# Altium schematic sheet Sheet1.SchDoc
size B; SheetNumber: 1; SheetTotal: 1
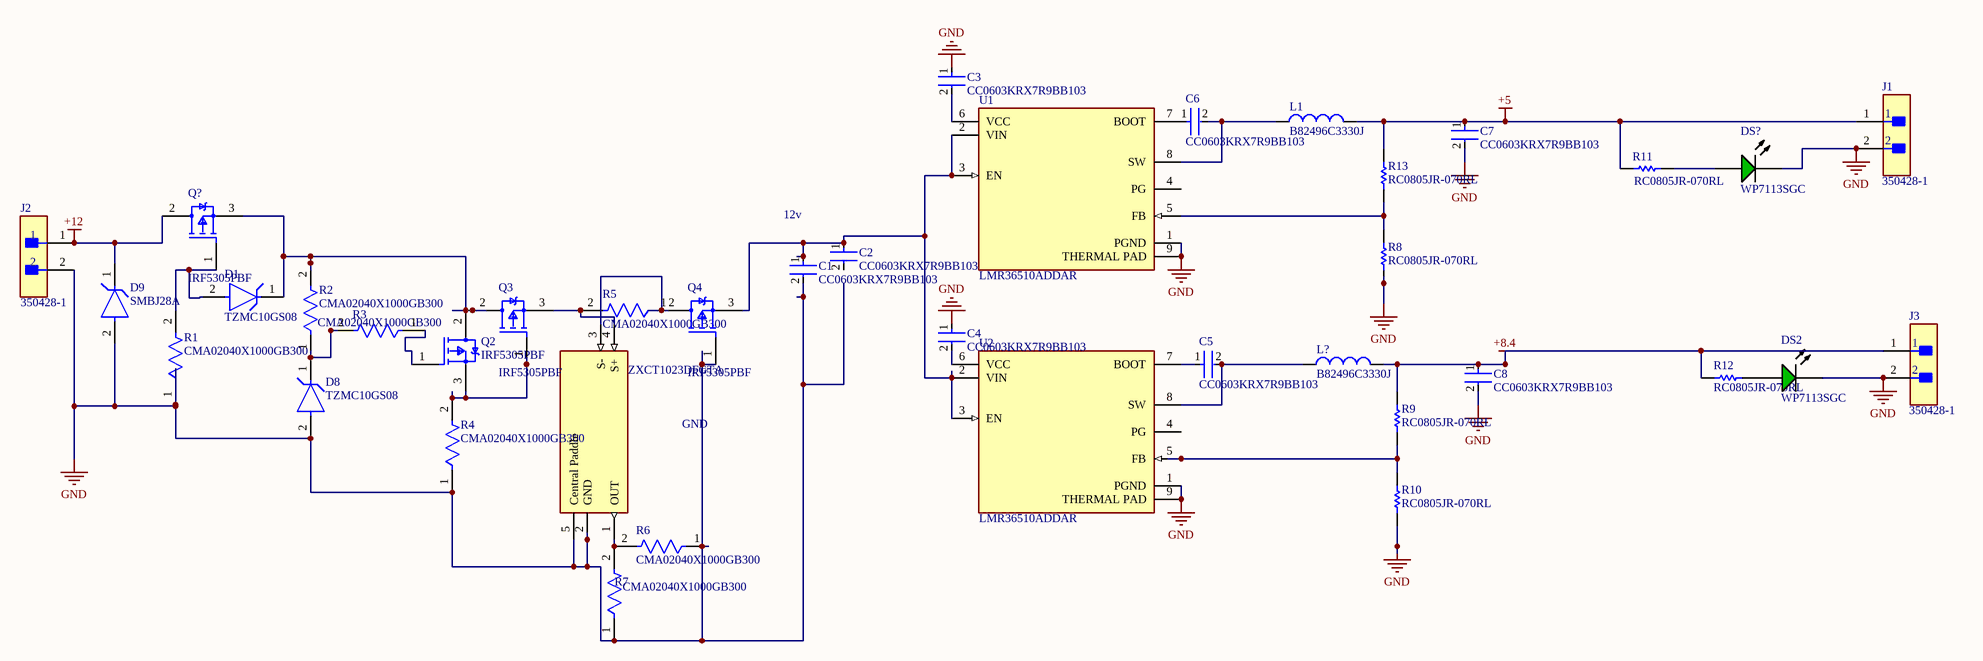
[diagram p0: Sheet1.SchDoc]

## Parts
?  ZXCT1023DFGTA  [FP-TDFN1218-4-MFG]
C1  CC0603KRX7R9BB103  [FP-CC0603-DA-MFG]
C2  CC0603KRX7R9BB103  [FP-CC0603-DA-MFG]
C3  CC0603KRX7R9BB103  [FP-CC0603-DA-MFG]
C4  CC0603KRX7R9BB103  [FP-CC0603-DA-MFG]
C5  CC0603KRX7R9BB103  [FP-CC0603-DA-MFG]
C6  CC0603KRX7R9BB103  [FP-CC0603-DA-MFG]
C7  CC0603KRX7R9BB103  [FP-CC0603-DA-MFG]
C8  CC0603KRX7R9BB103  [FP-CC0603-DA-MFG]
D1  TZMC10GS08  [FP-6_560-5005_01-4-MFG]
D8  TZMC10GS08  [FP-6_560-5005_01-4-MFG]
D9  SMBJ28A  [FP-SMBJ-MFG]
DS2  WP7113SGC  [KING-WP7113SGC_V]
DS?  WP7113SGC  [KING-WP7113SGC_V]
J1  350428-1  [FP-350428-1-MFG]
J2  350428-1  [FP-350428-1-MFG]
J3  350428-1  [FP-350428-1-MFG]
L1  B82496C3330J  [INDC1608X90X30LL10T20]
L?  B82496C3330J  [INDC1608X90X30LL10T20]
Q2  IRF5305PBF  [FP-PG-TO220-3-0]
Q3  IRF5305PBF  [FP-PG-TO220-3-0]
Q4  IRF5305PBF  [FP-PG-TO220-3-0]
Q?  IRF5305PBF  [FP-PG-TO220-3-0]
R1  CMA02040X1000GB300  [FP-CMA0204-MFG]
R2  CMA02040X1000GB300  [FP-CMA0204-MFG]
R3  CMA02040X1000GB300  [FP-CMA0204-MFG]
R4  CMA02040X1000GB300  [FP-CMA0204-MFG]
R5  CMA02040X1000GB300  [FP-CMA0204-MFG]
R6  CMA02040X1000GB300  [FP-CMA0204-MFG]
R7  CMA02040X1000GB300  [FP-CMA0204-MFG]
R8  RC0805JR-070RL  [RESC2013X60X35ML10T20]
R9  RC0805JR-070RL  [RESC2013X60X35ML10T20]
R10  RC0805JR-070RL  [RESC2013X60X35ML10T20]
R11  RC0805JR-070RL  [RESC2013X60X35ML10T20]
R12  RC0805JR-070RL  [RESC2013X60X35ML10T20]
R13  RC0805JR-070RL  [RESC2013X60X35ML10T20]
U1  LMR36510ADDAR  [FP-DDA0008E-IPC_A]
U2  LMR36510ADDAR  [FP-DDA0008E-IPC_A]

## Nets
+5: C7.1 J1.1 L1.2 R11.2 R13.2
+8.4: C8.1 J3.1 L?.2 R9.2 R12.2
+12: D9.1(C) J2.1 Q?.2(D)
GND: ?.2(GND) ?.5(Central_Paddle) C1.2 C3.1 C4.1 C7.2 C8.2 D8.2(A) D9.2(A) DS2.2(K) DS?.2(K) J1.2 J2.2 J3.2 Q4.1(G) R1.1 R4.1 R6.1 R7.1 R8.1 R10.1 U1.1(PGND) U1.9(THERMAL_PAD) U2.1(PGND) U2.9(THERMAL_PAD)
Net?_1: ?.1(OUT) R6.2 R7.2
Net?_3: ?.3(S-) Q4.2(D)
Net?_4: ?.4(S+) Q3.3(S) R5.2
NetC1_1: C1.1 C2.1 Q4.3(S) U1.2(VIN) U1.3(EN) U2.2(VIN) U2.3(EN)
NetC3_2: C3.2 U1.6(VCC)
NetC4_2: C4.2 U2.6(VCC)
NetC5_1: C5.1 U2.7(BOOT)
NetC5_2: C5.2 L?.1 U2.8(SW)
NetC6_1: C6.1 U1.7(BOOT)
NetC6_2: C6.2 L1.1 U1.8(SW)
NetD1_1: D1.1(C) Q2.2(D) Q3.2(D) Q?.3(S) R2.2
NetD1_2: D1.2(A) Q?.1(G) R1.2
NetD8_1: D8.1(C) R2.1 R3.2
NetDS2_1: DS2.1(A) R12.1
NetDS?_1: DS?.1(A) R11.1
NetQ2_1: Q2.1(G) R3.1
NetQ2_3: Q2.3(S) Q3.1(G) R4.2
NetR8_2: R8.2 R13.1 U1.5(FB)
NetR9_1: R9.1 R10.2 U2.5(FB)

Not connected (* = marked no-connect by the designer): C2 2; R5 1; U1 4(PG); U2 4(PG)

## Notes on the sheet
- 12v
- GND

## Library data of the parts
? = CMP-12749-000001-1: IC CUR SENSE MONITOR 4-TDFN; Input Current: 100nA; Bandwidth: 1MHz; Operating Supply Current: 3.5uA; Gain: 50dB; Quiescent Current: 3.5A; Max Supply Voltage: 20V; Accuracy: 3%; Min Supply Voltage: 2.5V; Packaging: Tape and Reel; Mount: Surface Mount; Package Quantity: 3000; Number of Pins: 4; Min Operating Temperature: -40°C; Radiation Hardening: No; Max Operating Temperature: 85°C; REACH SVHC: No SVHC; Lead Free: Lead Free; Weight: 0.001764oz
C1 = CMP-2100-03600-2: CAP CER 10000PF 50V X7R 0603; Manufacturer: YAGEO; Tolerance: 0.1; Material: Ceramic; Temperature Coefficient: 15%; Description: CC0603 10 nF X7R 10.00% 50 V; Value: 10 nF; Capacitance: 4.7µF; Mouser Description: Multilayer Ceramic Capacitor, CC Series, 0.01 - F, - 10%, X7R, 50 V, 0603 [1608 Metric]; Digikey Description: CAP CER 10000PF 50V X7R 0603; Height: 0.9mm; Category: Cap; Temperature Characteristic: X7R; Footprint Url: http://www.yageo.com/exep/pages/download/literatures/UPY-C_GEN_24.pdf; Lead Free: Yes; Voltage Rating: 50 V; Manufacturer Part Number: CC0603KRX7R9BB103; Temperature: -55°C to +125°C; Device Class L3: Ceramic Capacitors; ComponentLink2Description: Datasheet; Voltage: 50 V; Package: CC0603-DA; Octopart: https://octopart.com/cc0603krx7r9bb103-yageo-192938; Automotive: No; Temperature Range High: +125°C; Temperature Range Low: -55°C; RoHS: TRUE; Device Class L1: Passive Components; ComponentLink2URL: http://www.yageo.com/documents/recent/UPY-GPHC_X7R_6.3V-to-50V_18.pdf; Device Class L2: Capacitors
C2 C5 C6 = CMP-2100-03600-2: CAP CER 10000PF 50V X7R 0603; Manufacturer: YAGEO; Tolerance: 0.1; Material: Ceramic; Temperature Coefficient: 15%; Description: CC0603 10 nF X7R 10.00% 50 V; Value: 0.1µF; Mouser Description: Multilayer Ceramic Capacitor, CC Series, 0.01 - F, - 10%, X7R, 50 V, 0603 [1608 Metric]; Digikey Description: CAP CER 10000PF 50V X7R 0603; Height: 0.9mm; Category: Cap; Temperature Characteristic: X7R; Footprint Url: http://www.yageo.com/exep/pages/download/literatures/UPY-C_GEN_24.pdf; Lead Free: Yes; Voltage Rating: 50 V; Manufacturer Part Number: CC0603KRX7R9BB103; Temperature: -55°C to +125°C; Device Class L3: Ceramic Capacitors; ComponentLink2Description: Datasheet; Voltage: 50 V; Package: CC0603-DA; Octopart: https://octopart.com/cc0603krx7r9bb103-yageo-192938; Automotive: No; Temperature Range High: +125°C; Temperature Range Low: -55°C; RoHS: TRUE; Device Class L1: Passive Components; ComponentLink2URL: http://www.yageo.com/documents/recent/UPY-GPHC_X7R_6.3V-to-50V_18.pdf; Device Class L2: Capacitors; Capacitance: 0.1µF
C3 = CMP-2100-03600-2: CAP CER 10000PF 50V X7R 0603; Manufacturer: YAGEO; Tolerance: 0.1; Material: Ceramic; Temperature Coefficient: 15%; Description: CC0603 10 nF X7R 10.00% 50 V; Value: 0.1µF; Capacitance: 1µF; Mouser Description: Multilayer Ceramic Capacitor, CC Series, 0.01 - F, - 10%, X7R, 50 V, 0603 [1608 Metric]; Digikey Description: CAP CER 10000PF 50V X7R 0603; Height: 0.9mm; Category: Cap; Temperature Characteristic: X7R; Footprint Url: http://www.yageo.com/exep/pages/download/literatures/UPY-C_GEN_24.pdf; Lead Free: Yes; Voltage Rating: 50 V; Manufacturer Part Number: CC0603KRX7R9BB103; Temperature: -55°C to +125°C; Device Class L3: Ceramic Capacitors; ComponentLink2Description: Datasheet; Voltage: 50 V; Package: CC0603-DA; Octopart: https://octopart.com/cc0603krx7r9bb103-yageo-192938; Automotive: No; Temperature Range High: +125°C; Temperature Range Low: -55°C; RoHS: TRUE; Device Class L1: Passive Components; ComponentLink2URL: http://www.yageo.com/documents/recent/UPY-GPHC_X7R_6.3V-to-50V_18.pdf; Device Class L2: Capacitors
C4 = CMP-2100-03600-2: CAP CER 10000PF 50V X7R 0603; Manufacturer: YAGEO; Tolerance: 0.1; Material: Ceramic; Temperature Coefficient: 15%; Description: CC0603 10 nF X7R 10.00% 50 V; Value: 1µF; Mouser Description: Multilayer Ceramic Capacitor, CC Series, 0.01 - F, - 10%, X7R, 50 V, 0603 [1608 Metric]; Digikey Description: CAP CER 10000PF 50V X7R 0603; Height: 0.9mm; Category: Cap; Temperature Characteristic: X7R; Footprint Url: http://www.yageo.com/exep/pages/download/literatures/UPY-C_GEN_24.pdf; Lead Free: Yes; Voltage Rating: 50 V; Manufacturer Part Number: CC0603KRX7R9BB103; Temperature: -55°C to +125°C; Device Class L3: Ceramic Capacitors; ComponentLink2Description: Datasheet; Voltage: 50 V; Package: CC0603-DA; Octopart: https://octopart.com/cc0603krx7r9bb103-yageo-192938; Automotive: No; Temperature Range High: +125°C; Temperature Range Low: -55°C; RoHS: TRUE; Device Class L1: Passive Components; ComponentLink2URL: http://www.yageo.com/documents/recent/UPY-GPHC_X7R_6.3V-to-50V_18.pdf; Device Class L2: Capacitors; Capacitance: 1µF
C7 = CMP-2100-03600-2: CAP CER 10000PF 50V X7R 0603; Manufacturer: YAGEO; Tolerance: 0.1; Material: Ceramic; Temperature Coefficient: 15%; Description: CC0603 10 nF X7R 10.00% 50 V; Value: 1.5µF; Mouser Description: Multilayer Ceramic Capacitor, CC Series, 0.01 - F, - 10%, X7R, 50 V, 0603 [1608 Metric]; Digikey Description: CAP CER 10000PF 50V X7R 0603; Height: 0.9mm; Category: Cap; Temperature Characteristic: X7R; Footprint Url: http://www.yageo.com/exep/pages/download/literatures/UPY-C_GEN_24.pdf; Lead Free: Yes; Voltage Rating: 50 V; Manufacturer Part Number: CC0603KRX7R9BB103; Temperature: -55°C to +125°C; Device Class L3: Ceramic Capacitors; ComponentLink2Description: Datasheet; Voltage: 50 V; Package: CC0603-DA; Octopart: https://octopart.com/cc0603krx7r9bb103-yageo-192938; Automotive: No; Temperature Range High: +125°C; Temperature Range Low: -55°C; RoHS: TRUE; Device Class L1: Passive Components; ComponentLink2URL: http://www.yageo.com/documents/recent/UPY-GPHC_X7R_6.3V-to-50V_18.pdf; Device Class L2: Capacitors; Capacitance: 1.5µF
C8 = CMP-2100-03600-2: CAP CER 10000PF 50V X7R 0603; Manufacturer: YAGEO; Tolerance: 0.1; Material: Ceramic; Temperature Coefficient: 15%; Description: CC0603 10 nF X7R 10.00% 50 V; Value: 0.39µF; Mouser Description: Multilayer Ceramic Capacitor, CC Series, 0.01 - F, - 10%, X7R, 50 V, 0603 [1608 Metric]; Digikey Description: CAP CER 10000PF 50V X7R 0603; Height: 0.9mm; Category: Cap; Temperature Characteristic: X7R; Footprint Url: http://www.yageo.com/exep/pages/download/literatures/UPY-C_GEN_24.pdf; Lead Free: Yes; Voltage Rating: 50 V; Manufacturer Part Number: CC0603KRX7R9BB103; Temperature: -55°C to +125°C; Device Class L3: Ceramic Capacitors; ComponentLink2Description: Datasheet; Voltage: 50 V; Package: CC0603-DA; Octopart: https://octopart.com/cc0603krx7r9bb103-yageo-192938; Automotive: No; Temperature Range High: +125°C; Temperature Range Low: -55°C; RoHS: TRUE; Device Class L1: Passive Components; ComponentLink2URL: http://www.yageo.com/documents/recent/UPY-GPHC_X7R_6.3V-to-50V_18.pdf; Device Class L2: Capacitors; Capacitance: 0.39µF
D1 D8 = CMP-00030-07941520-1: TZMC10GS08 Diode Zener Single 10 Volt 5% 500mW 2-Pin Quadro MELF SOD-80 Tape and Reel; Forward Voltage: 1.5V; Zener Voltage: 10V; Current: 1A; Max Reverse Leakage Current: 100nA; Peak Reverse Current: 100mA; Test Current: 5mA; Impedance: 15Ω; Number of Pins: 2; Tolerance: 5%; Height: 1.6mm; Power Dissipation: 500mW; Min Operating Temperature: -65°C; NexarPartId: 7941520; Max Operating Temperature: 175°C; Lead Free: Lead Free; Width: 1.6mm; Voltage Tolerance: 5%; Element Configuration: Single; Max Power Dissipation: 500mW; Voltage: 10V; RoHS: Compliant; Radiation Hardening: No; Schedule B: 8541100050, 8541100050; Mount: Surface Mount; Working Voltage: 10V; Length: 3.7mm
D9 = CMP-08607-000081-1: TVS DIODE 28V 45.4V DO214AA; Manufacturer: Littelfuse Inc; Breakdown Voltage: 31.1V; Direction: Unidirectional; Number Of Channels: 1; Peak Pulse Power: 600W; Max Junction Temp: +150°C; Peak Pulse Current: 13.3A; Temperature: -65°C to +150°C; Category: Diode; RoHS: TRUE; Height: 2.61mm; Reverse Standoff Voltage: 28V; Device Class L1: Circuit Protection; Temperature Range Low: -65°C; ComponentLink2Description: Datasheet; Digikey Description: TVS DIODE 28V 45.4V DO214AA; Automotive: No; Package: SMBJ; Mouser Description: Littelfuse SMBJ28A, Uni-Directional TVS Diode, 600W, 2-Pin DO-214AA; ComponentLink2URL: https://www.littelfuse.com/~/media/electronics/datasheets/tvs_diodes/littelfuse_tvs_diode_smbj_datasheet.pdf.pdf; Manufacturer Part Number: SMBJ28A; Octopart: https://octopart.com/smbj28a-littelfuse-350790; Clamping Voltage: 45.4V; Temperature Range High: +150°C; Device Class L3: unset; Device Class L2: TVS Diodes; Lead Free: Yes
DS2 DS? = CMP-1757-00001-1: The Super Bright Green Source Color Device, 2.2 V, -40 to 85 degC, 2-Pin THD, RoHS, Tape and Reel; Viewing Angle: 170 degrees; Lens Style: Diffused; Luminous Intensity: 8 mcd; Illumination Colour: Yellow; Forward Voltage: 2.1 V; Case\Package: 0603; Nominal Wavelength: 586 nm; Power Rating: 52 mW; Forward Current: 20 mA; Case Code (Imperial): 0603; Packaging: Tape and Reel; Case Code (Metric): 1608; Length: 1.6 mm; Mount: Surface Mount; DatasheetVersion: Rev. 9B, 01/2015; RoHSCompliant: true; ComponentLink1URL: http://www.kingbrightusa.com/images/catalog/SPEC/WP7113SGC.pdf; Colour: Yellow; Width: 0.8 mm; Min Operating Temperature: -40 degC; Pins: 2; PackageReference: WP7113SGC; Package Quantity: 4000; PackageDescription: 2-Pin Through Hole Device, Dia 5.9 mm, Body Length 8.6 mm; Radiation Hardening: No; ComponentLink1Description: Datasheet; Height: 0.8 mm; Max Operating Temperature: 85 degC; Nominal Vf: 2.1 V
J1-J3 = CMP-03369-000080-1: CONN HEADER VERT 2POS 6.35MM; Manufacturer: TE Connectivity; Standoff Height: 0.63mm; Number Of Contacts: 2; Conn Gender: Male; Voltage Rating: 600V; Conn Orientation: Vertical; Current Rating: 12A; Number Of Rows: 1; Mouser Description: Connector, Soft Shell; Universal MATE-N-LOK; 2; Nylon; Natural; 19 A; 600 VAC; Height: 14.99mm; Pitch: 6.35mm; ComponentLink2URL: https://www.te.com/commerce/DocumentDelivery/DDEController?Action=showdoc&DocId=Customer+Drawing%7F350428%7FY2%7Fpdf%7FEnglish%7FENG_CD_350428_Y2.pdf%7F350428-1; Device Class L1: Connectors; Automotive: No; Octopart: https://octopart.com/350428-1-te+connectivity-46505355; Digikey Description: CONN HEADER VERT 2POS 6.35MM; RoHS: TRUE; Temperature: -40°C to +105°C; Contact Material: Gold,Nickel; Package: 350428-1; Temperature Range Low: -40°C; Device Class L3: unset; Lead Free: Yes; Device Class L2: Headers and Wire Housings; Category: Conn; ComponentLink2Description: Datasheet; Temperature Range High: +105°C; Manufacturer Part Number: 350428-1
L1 = CMP-2000-05913-1: Unshielded Wirewound Inductor, 33 nH, 350 mA, -55 to 150 degC, 0603 (1608 Metric), RoHS, Tape and Reel; Manufacturer: EPCOS-(TDK); Q @ Freq: 14@100MHz; Inductance: 22µH; Material - Core: Ceramic; Frequency - Self Resonant: 3GHz; DC Resistance (DCR): 600mOhmMax; Tolerance: ±5%; Frequency - Test: 100MHz; Current Rating: 350mA; Manufacturer URL: http://www.tdk.com/; Type: Wirewound; Mounting Type: SurfaceMount; Mounting Technology: SurfaceMount; Height - Seated (Max): 0.035"(0.90mm); Datasheet URL: https://en.tdk.eu/inf/30/db/ind_2008/b82496c.pdf; Shielding: Unshielded; Operating Temperature: -; Size / Dimension: 0.063"Lx0.031"W(1.60mmx0.80mm); Series: SIMID; Current - Saturation: -; Ratings: AEC-Q200; Packaging: CutTape(CT); Package Reference: 0603; Datasheet Version: 07/2016; Category: Inductors,Coils,Chokes; Package Description: 2-Pin Surface Mount Device, Body 1.6 x 0.8 mm; Family: FixedInductors; Package / Case: 0603(1608Metric)
L? = CMP-2000-05913-1: Unshielded Wirewound Inductor, 33 nH, 350 mA, -55 to 150 degC, 0603 (1608 Metric), RoHS, Tape and Reel; Manufacturer: EPCOS-(TDK); Q @ Freq: 14@100MHz; Inductance: 20µH; Material - Core: Ceramic; Frequency - Self Resonant: 3GHz; DC Resistance (DCR): 600mOhmMax; Tolerance: ±5%; Frequency - Test: 100MHz; Current Rating: 350mA; Manufacturer URL: http://www.tdk.com/; Type: Wirewound; Mounting Type: SurfaceMount; Mounting Technology: SurfaceMount; Height - Seated (Max): 0.035"(0.90mm); Datasheet URL: https://en.tdk.eu/inf/30/db/ind_2008/b82496c.pdf; Shielding: Unshielded; Operating Temperature: -; Size / Dimension: 0.063"Lx0.031"W(1.60mmx0.80mm); Series: SIMID; Current - Saturation: -; Ratings: AEC-Q200; Packaging: CutTape(CT); Package Reference: 0603; Datasheet Version: 07/2016; Category: Inductors,Coils,Chokes; Package Description: 2-Pin Surface Mount Device, Body 1.6 x 0.8 mm; Family: FixedInductors; Package / Case: 0603(1608Metric)
Q2-Q4 Q? = CMP-32901-000003-1: MOSFET P-CH 55V 31A TO-220AB; Manufacturer: Infineon; Max Forward Diode Voltage: -1.3V; Continuous Drain Current: -31A; Standoff Height: 3.55mm; Power Dissipation: 110W; Number Of Channels: 1; Rthja Max: 62°C/W; Depletion Mode: False; Drain To Source Resistance: 0.06Ω; Input Capacitace At Vds: 1200pF @ -25V; Reverse Recovery Time: 71ns; Gate Charge At Vgs: 63nC @ -10V; Gate To Source Voltage: 20V; Turn Off Delay Time: 39ns; Turn On Delay Time: 14ns; Drain To Source Breakdown Voltage: -55V; Threshold Vgs Min: -2V; Max Junction Temp: +175°C; Pulse Drain Current: -110A; Reverse Recovery Charge: 170nC; Threshold Vgs Max: -4V; Device Class L1: Discrete Semiconductors; Lead Free: Yes; Temperature Range High: +175°C; Device Class L2: Transistors; Package: PG-TO220-3; Octopart: https://octopart.com/irf5305pbf-infineon-65873396; RoHS: TRUE; Number Of P Channels: 1; Manufacturer Part Number: IRF5305PBF; Category: Trans; Digikey Description: MOSFET P-CH 55V 31A TO-220AB; Device Class L3: MOSFETs; Height: 19.3mm; Automotive: No; Temperature Range Low: -55°C; Temperature: -55°C to +175°C; ComponentLink2URL: https://www.infineon.com/dgdl/irf5305pbf.pdf?fileId=5546d462533600a4015355e370101993; Drain To Source Voltage: -55V; ComponentLink2Description: Datasheet
R1 R3 = CMP-00030-42810921-1: CMA02040X1000GB300 Surface Mount MELF Resistor, 100 Ohm, ± 2%, 250 mW, 0204 [3715 Metric], Carbon Film; Voltage Rating (DC): 200V; Resistance: 100kΩ; Power Rating: 400mW; Temperature Coefficient: -250ppm/°C; Number of Terminations: 2; Lead Free: Lead Free; Contact Plating: Tin; REACH SVHC: Unknown; Case/Package: 0204; Length: 3.6mm; Diameter: 1.4mm; Packaging: Digi-Reel®; Operating Supply Voltage: 200V; Military Standard: Not; Min Operating Temperature: -55°C; NexarPartId: 42810921; Termination: Wraparound; RoHS: Compliant; Composition: Carbon Film; Tolerance: 2%; Max Operating Temperature: 125°C; Schedule B: 8533100042, 8533100042; Mount: Surface Mount; Width: 3.6mm; Voltage Rating: 200V; Max Power Dissipation: 400mW; Radiation Hardening: No; Number of Pins: 2; Weight: 18.99418mg
R2 = CMP-00030-42810921-1: CMA02040X1000GB300 Surface Mount MELF Resistor, 100 Ohm, ± 2%, 250 mW, 0204 [3715 Metric], Carbon Film; Voltage Rating (DC): 200V; Resistance: 2.7kΩ; Power Rating: 400mW; Temperature Coefficient: -250ppm/°C; Number of Terminations: 2; Lead Free: Lead Free; Contact Plating: Tin; REACH SVHC: Unknown; Case/Package: 0204; Length: 3.6mm; Diameter: 1.4mm; Packaging: Digi-Reel®; Operating Supply Voltage: 200V; Military Standard: Not; Min Operating Temperature: -55°C; NexarPartId: 42810921; Termination: Wraparound; RoHS: Compliant; Composition: Carbon Film; Tolerance: 2%; Max Operating Temperature: 125°C; Schedule B: 8533100042, 8533100042; Mount: Surface Mount; Width: 3.6mm; Voltage Rating: 200V; Max Power Dissipation: 400mW; Radiation Hardening: No; Number of Pins: 2; Weight: 18.99418mg
R4 = CMP-00030-42810921-1: CMA02040X1000GB300 Surface Mount MELF Resistor, 100 Ohm, ± 2%, 250 mW, 0204 [3715 Metric], Carbon Film; Voltage Rating (DC): 200V; Resistance: 6.8kΩ; Power Rating: 400mW; Temperature Coefficient: -250ppm/°C; Number of Terminations: 2; Lead Free: Lead Free; Contact Plating: Tin; REACH SVHC: Unknown; Case/Package: 0204; Length: 3.6mm; Diameter: 1.4mm; Packaging: Digi-Reel®; Operating Supply Voltage: 200V; Military Standard: Not; Min Operating Temperature: -55°C; NexarPartId: 42810921; Termination: Wraparound; RoHS: Compliant; Composition: Carbon Film; Tolerance: 2%; Max Operating Temperature: 125°C; Schedule B: 8533100042, 8533100042; Mount: Surface Mount; Width: 3.6mm; Voltage Rating: 200V; Max Power Dissipation: 400mW; Radiation Hardening: No; Number of Pins: 2; Weight: 18.99418mg
R5 = CMP-00030-42810921-1: CMA02040X1000GB300 Surface Mount MELF Resistor, 100 Ohm, ± 2%, 250 mW, 0204 [3715 Metric], Carbon Film; Voltage Rating (DC): 200V; Resistance: 20mΩ; Power Rating: 400mW; Temperature Coefficient: -250ppm/°C; Number of Terminations: 2; Lead Free: Lead Free; Contact Plating: Tin; REACH SVHC: Unknown; Case/Package: 0204; Length: 3.6mm; Diameter: 1.4mm; Packaging: Digi-Reel®; Operating Supply Voltage: 200V; Military Standard: Not; Min Operating Temperature: -55°C; NexarPartId: 42810921; Termination: Wraparound; RoHS: Compliant; Composition: Carbon Film; Tolerance: 2%; Max Operating Temperature: 125°C; Schedule B: 8533100042, 8533100042; Mount: Surface Mount; Width: 3.6mm; Voltage Rating: 200V; Max Power Dissipation: 400mW; Radiation Hardening: No; Number of Pins: 2; Weight: 18.99418mg
R6 = CMP-00030-42810921-1: CMA02040X1000GB300 Surface Mount MELF Resistor, 100 Ohm, ± 2%, 250 mW, 0204 [3715 Metric], Carbon Film; Voltage Rating (DC): 200V; Resistance: 2kΩ; Power Rating: 400mW; Temperature Coefficient: -250ppm/°C; Number of Terminations: 2; Lead Free: Lead Free; Contact Plating: Tin; REACH SVHC: Unknown; Case/Package: 0204; Length: 3.6mm; Diameter: 1.4mm; Packaging: Digi-Reel®; Operating Supply Voltage: 200V; Military Standard: Not; Min Operating Temperature: -55°C; NexarPartId: 42810921; Termination: Wraparound; RoHS: Compliant; Composition: Carbon Film; Tolerance: 2%; Max Operating Temperature: 125°C; Schedule B: 8533100042, 8533100042; Mount: Surface Mount; Width: 3.6mm; Voltage Rating: 200V; Max Power Dissipation: 400mW; Radiation Hardening: No; Number of Pins: 2; Weight: 18.99418mg
R7 = CMP-00030-42810921-1: CMA02040X1000GB300 Surface Mount MELF Resistor, 100 Ohm, ± 2%, 250 mW, 0204 [3715 Metric], Carbon Film; Voltage Rating (DC): 200V; Resistance: 6kΩ; Power Rating: 400mW; Temperature Coefficient: -250ppm/°C; Number of Terminations: 2; Lead Free: Lead Free; Contact Plating: Tin; REACH SVHC: Unknown; Case/Package: 0204; Length: 3.6mm; Diameter: 1.4mm; Packaging: Digi-Reel®; Operating Supply Voltage: 200V; Military Standard: Not; Min Operating Temperature: -55°C; NexarPartId: 42810921; Termination: Wraparound; RoHS: Compliant; Composition: Carbon Film; Tolerance: 2%; Max Operating Temperature: 125°C; Schedule B: 8533100042, 8533100042; Mount: Surface Mount; Width: 3.6mm; Voltage Rating: 200V; Max Power Dissipation: 400mW; Radiation Hardening: No; Number of Pins: 2; Weight: 18.99418mg
R8 R9 = CMP-2100-03673-1: Chip Resistor, 0 Ohm, Jumper, +/- 5%, 0.125 W, -55 to 155 degC, 0805 (2012 Metric), RoHS, Tape and Reel; Manufacturer: Yageo; Power Rating: 125mW; Resistance: 24.9kOhm; Voltage Rating (DC): 150V; Temperature Coefficient: 200ppm/degreesC; Height: 0.5mm; Depth: 1.25mm; Case Code (Imperial): 0805; Lead Free: LeadFree; Military Standard: Not; Package Description: 2-Pin Surface Mounted Device, Body 2 x 1.25 mm; Case Code (Metric): 2012; Composition: ThickFilm; Voltage Rating: 150V; Manufacturer URL: http://www.yageo.com/; Packaging: TapeandReel; Package Reference: 0805; REACH SVHC: Unknown; Tolerance: 5%; Case/Package: 0805; Max Operating Temperature: 155degC; Number of Pins: 2; Min Operating Temperature: -55degC; RoHSCompliant: true; Length: 2mm; Datasheet URL: http://www.yageo.com/NewPortal/yageodocoutput?fileName=/pdf/R-Chip/PYu-RC_Group_51_RoHS_L_5.pdf; Termination: SMD/SMT; Radiation Hardening: No; Width: 1.25mm; Contact Plating: Tin; Datasheet Version: Rev. 5, 10/2016
R10 = CMP-2100-03673-1: Chip Resistor, 0 Ohm, Jumper, +/- 5%, 0.125 W, -55 to 155 degC, 0805 (2012 Metric), RoHS, Tape and Reel; Manufacturer: Yageo; Power Rating: 125mW; Resistance: 2.7kOhm; Voltage Rating (DC): 150V; Temperature Coefficient: 200ppm/degreesC; Height: 0.5mm; Depth: 1.25mm; Case Code (Imperial): 0805; Lead Free: LeadFree; Military Standard: Not; Package Description: 2-Pin Surface Mounted Device, Body 2 x 1.25 mm; Case Code (Metric): 2012; Composition: ThickFilm; Voltage Rating: 150V; Manufacturer URL: http://www.yageo.com/; Packaging: TapeandReel; Package Reference: 0805; REACH SVHC: Unknown; Tolerance: 5%; Case/Package: 0805; Max Operating Temperature: 155degC; Number of Pins: 2; Min Operating Temperature: -55degC; RoHSCompliant: true; Length: 2mm; Datasheet URL: http://www.yageo.com/NewPortal/yageodocoutput?fileName=/pdf/R-Chip/PYu-RC_Group_51_RoHS_L_5.pdf; Termination: SMD/SMT; Radiation Hardening: No; Width: 1.25mm; Contact Plating: Tin; Datasheet Version: Rev. 5, 10/2016
R11 = CMP-2100-03673-1: Chip Resistor, 0 Ohm, Jumper, +/- 5%, 0.125 W, -55 to 155 degC, 0805 (2012 Metric), RoHS, Tape and Reel; Manufacturer: Yageo; Power Rating: 125mW; Resistance: 166.66666Ohm; Voltage Rating (DC): 150V; Temperature Coefficient: 200ppm/degreesC; Height: 0.5mm; Depth: 1.25mm; Case Code (Imperial): 0805; Lead Free: LeadFree; Military Standard: Not; Package Description: 2-Pin Surface Mounted Device, Body 2 x 1.25 mm; Case Code (Metric): 2012; Composition: ThickFilm; Voltage Rating: 150V; Manufacturer URL: http://www.yageo.com/; Packaging: TapeandReel; Package Reference: 0805; REACH SVHC: Unknown; Tolerance: 5%; Case/Package: 0805; Max Operating Temperature: 155degC; Number of Pins: 2; Min Operating Temperature: -55degC; RoHSCompliant: true; Length: 2mm; Datasheet URL: http://www.yageo.com/NewPortal/yageodocoutput?fileName=/pdf/R-Chip/PYu-RC_Group_51_RoHS_L_5.pdf; Termination: SMD/SMT; Radiation Hardening: No; Width: 1.25mm; Contact Plating: Tin; Datasheet Version: Rev. 5, 10/2016
R12 = CMP-2100-03673-1: Chip Resistor, 0 Ohm, Jumper, +/- 5%, 0.125 W, -55 to 155 degC, 0805 (2012 Metric), RoHS, Tape and Reel; Manufacturer: Yageo; Power Rating: 125mW; Resistance: 280Ohm; Voltage Rating (DC): 150V; Temperature Coefficient: 200ppm/degreesC; Height: 0.5mm; Depth: 1.25mm; Case Code (Imperial): 0805; Lead Free: LeadFree; Military Standard: Not; Package Description: 2-Pin Surface Mounted Device, Body 2 x 1.25 mm; Case Code (Metric): 2012; Composition: ThickFilm; Voltage Rating: 150V; Manufacturer URL: http://www.yageo.com/; Packaging: TapeandReel; Package Reference: 0805; REACH SVHC: Unknown; Tolerance: 5%; Case/Package: 0805; Max Operating Temperature: 155degC; Number of Pins: 2; Min Operating Temperature: -55degC; RoHSCompliant: true; Length: 2mm; Datasheet URL: http://www.yageo.com/NewPortal/yageodocoutput?fileName=/pdf/R-Chip/PYu-RC_Group_51_RoHS_L_5.pdf; Termination: SMD/SMT; Radiation Hardening: No; Width: 1.25mm; Contact Plating: Tin; Datasheet Version: Rev. 5, 10/2016
R13 = CMP-2100-03673-1: Chip Resistor, 0 Ohm, Jumper, +/- 5%, 0.125 W, -55 to 155 degC, 0805 (2012 Metric), RoHS, Tape and Reel; Manufacturer: Yageo; Power Rating: 125mW; Resistance: 100kOhm; Voltage Rating (DC): 150V; Temperature Coefficient: 200ppm/degreesC; Height: 0.5mm; Depth: 1.25mm; Case Code (Imperial): 0805; Lead Free: LeadFree; Military Standard: Not; Package Description: 2-Pin Surface Mounted Device, Body 2 x 1.25 mm; Case Code (Metric): 2012; Composition: ThickFilm; Voltage Rating: 150V; Manufacturer URL: http://www.yageo.com/; Packaging: TapeandReel; Package Reference: 0805; REACH SVHC: Unknown; Tolerance: 5%; Case/Package: 0805; Max Operating Temperature: 155degC; Number of Pins: 2; Min Operating Temperature: -55degC; RoHSCompliant: true; Length: 2mm; Datasheet URL: http://www.yageo.com/NewPortal/yageodocoutput?fileName=/pdf/R-Chip/PYu-RC_Group_51_RoHS_L_5.pdf; Termination: SMD/SMT; Radiation Hardening: No; Width: 1.25mm; Contact Plating: Tin; Datasheet Version: Rev. 5, 10/2016
U1 U2 = CMP-04918-000232-1: 65V 2.5A SYNCHRONOUS BUCK CONVER; RoHS Compliant: Yes